# Altium project SCROD_TO_RJ45_BOARD.PrjPcb
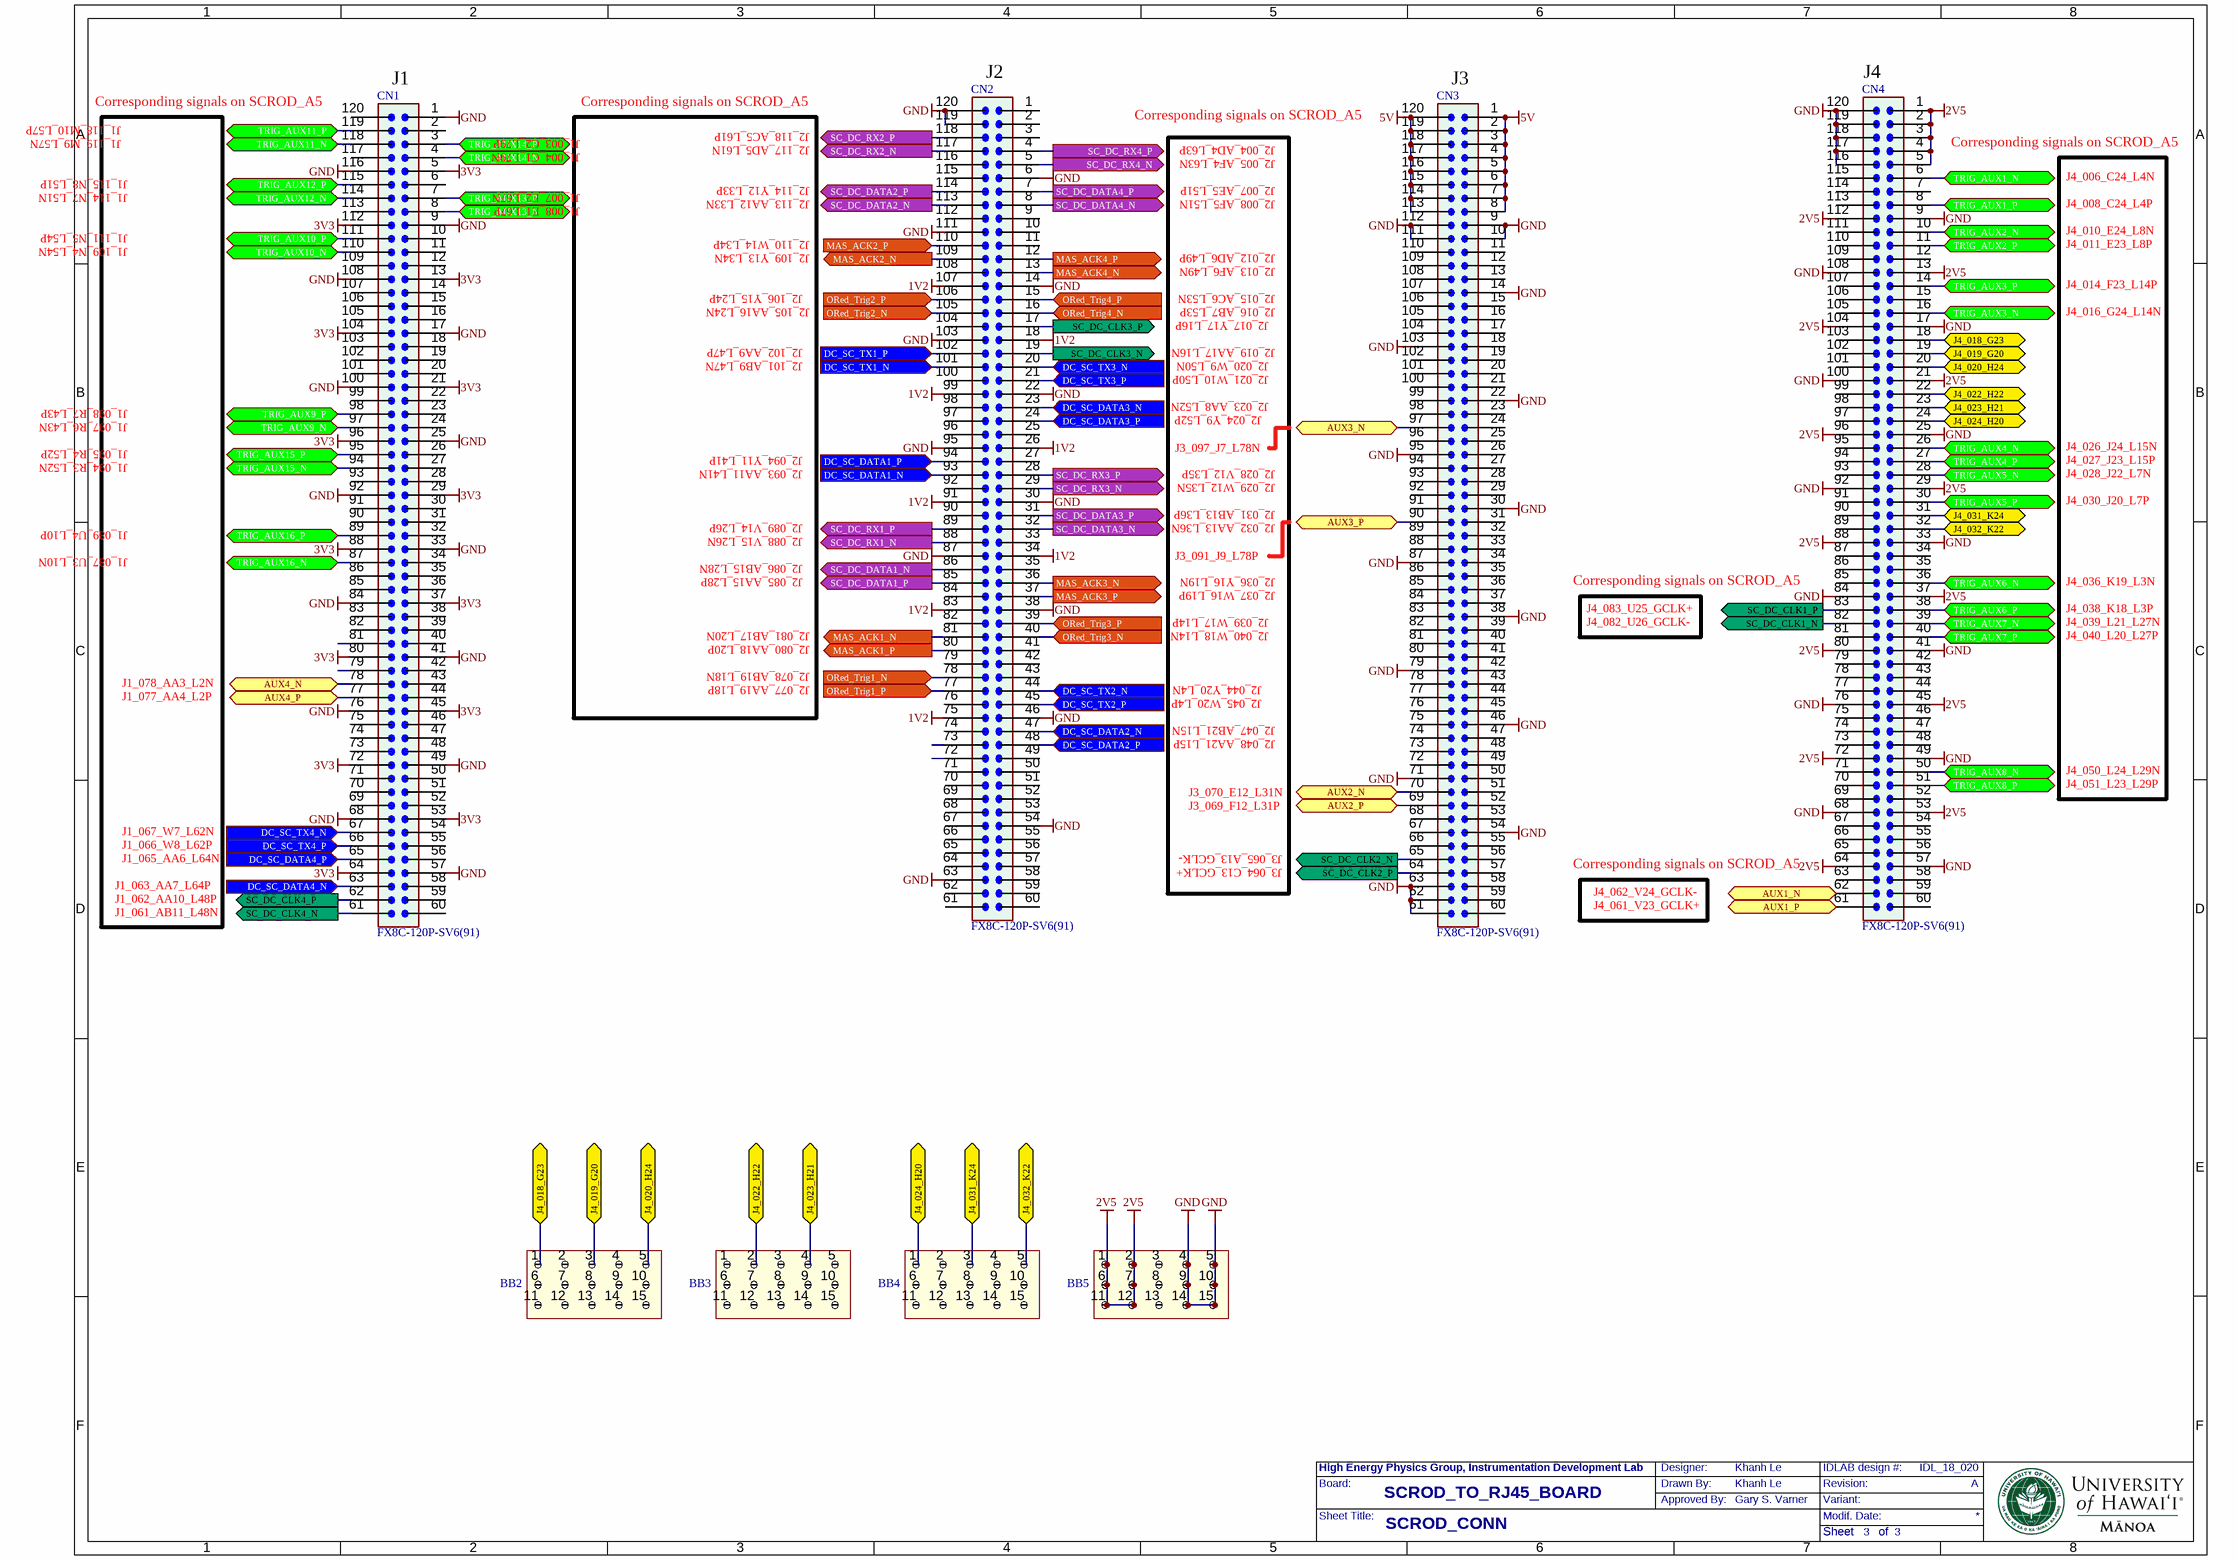
[diagram p0: SCROD_CONN_A2.SchDoc]
Approved_By: Gary S. Varner; BoardName: SCROD_TO_RJ45_BOARD; Designer: Khanh Le; Drawn_By: Khanh Le; IDLnum: IDL_18_020; ProjectName1: HMB; RevNum: A
3 sheets, 66 parts. Net scope: flat (ports and power ports of the same name join across sheets).
Board file: IDL_18_020.PcbDoc
Sheets:
  PRJHdr_IDL_18_020.SchDoc
  SCROD_CONN_A2.SchDoc
  FMC_CONN_A1.SchDoc

## Sheet PRJHdr_IDL_18_020.SchDoc: SCROD_TO_FMC_BOARD
size 401 x 291 mm; DocumentNumber: 1; SheetNumber: 1; SheetTotal: 3; Project_IT-Code: XXXX

### Notes on the sheet
- High Energy Physics Group
- Instrumentation Development Laboratory
- 2505 Correa Road, Honolulu, HI 96822
- Production Documentation for:
- Board Name:
- Project Name:
- IDL num:
- Revision:
- Variant:
- Designer:
- Drawn by:
- Approved by:
- Project name:
- High Energy Physics Group, Instrumentation Development Lab
- Drawn By:
- Approved By:
- IDLAB design #:
- Board name:
- Modif. Date:
- Sheet       of

## Sheet SCROD_CONN_A2.SchDoc: SCROD_CONN
size 401 x 291 mm; DocumentNumber: 3; SheetNumber: 3; SheetTotal: 3

### Parts
BB2  (no value)  [Breadboard_3x5_100mil_pitch]
BB3  (no value)  [Breadboard_3x5_100mil_pitch]
BB4  (no value)  [Breadboard_3x5_100mil_pitch]
BB5  (no value)  [Breadboard_3x5_100mil_pitch]
CN1  FX8C-120P-SV6(91)  [FX8C-120P-SV6(91)]
CN2  FX8C-120P-SV6(91)  [FX8C-120P-SV6(91)]
CN3  FX8C-120P-SV6(91)  [FX8C-120P-SV6(91)]
CN4  FX8C-120P-SV6(91)  [FX8C-120P-SV6(91)]

### Ports
AUX1_N (bidir), AUX1_P (bidir), AUX2_N (bidir), AUX2_P (bidir), AUX3_N (bidir), AUX3_P (bidir), AUX4_N (bidir), AUX4_P (bidir), DC_SC_DATA1_N (in), DC_SC_DATA1_P (in), DC_SC_DATA2_N (in), DC_SC_DATA2_P (in), DC_SC_DATA3_N (in), DC_SC_DATA3_P (in), DC_SC_DATA4_N (in), DC_SC_DATA4_P (in), DC_SC_TX1_N (in), DC_SC_TX1_P (in), DC_SC_TX2_N (in), DC_SC_TX2_P (in), DC_SC_TX3_N (in), DC_SC_TX3_P (in), DC_SC_TX4_N (in), DC_SC_TX4_P (in), J4_018_G23 (bidir), J4_019_G20 (bidir), J4_020_H24 (bidir), J4_022_H22 (bidir), J4_023_H21 (bidir), J4_024_H20 (bidir), J4_031_K24 (bidir), J4_032_K22 (bidir), MAS_ACK1_N (out), MAS_ACK1_P (out), MAS_ACK2_N (out), MAS_ACK2_P (in), MAS_ACK3_N (out), MAS_ACK3_P (out), MAS_ACK4_N (out), MAS_ACK4_P (out), ORed_Trig1_N (in), ORed_Trig1_P (in), ORed_Trig2_N (in), ORed_Trig2_P (in), ORed_Trig3_N (in), ORed_Trig3_P (in), ORed_Trig4_N (in), ORed_Trig4_P (in), SC_DC_CLK1_N (out), SC_DC_CLK1_P (out), SC_DC_CLK2_N (out), SC_DC_CLK2_P (out), SC_DC_CLK3_N (out), SC_DC_CLK3_P (out), SC_DC_CLK4_N (out), SC_DC_CLK4_P (out), SC_DC_DATA1_N (out), SC_DC_DATA1_P (out), SC_DC_DATA2_N (out), SC_DC_DATA2_P (out), SC_DC_DATA3_N (out), SC_DC_DATA3_P (out), SC_DC_DATA4_N (out), SC_DC_DATA4_P (out), SC_DC_RX1_N (out), SC_DC_RX1_P (out), SC_DC_RX2_N (out), SC_DC_RX2_P (out), SC_DC_RX3_N (out), SC_DC_RX3_P (out), SC_DC_RX4_N (out), SC_DC_RX4_P (out), TRIG_AUX1_N (bidir), TRIG_AUX1_P (bidir), TRIG_AUX2_N (bidir), TRIG_AUX2_P (bidir), TRIG_AUX3_N (bidir), TRIG_AUX3_P (bidir), TRIG_AUX4_N (bidir), TRIG_AUX4_P (bidir), TRIG_AUX5_N (bidir), TRIG_AUX5_P (bidir), TRIG_AUX6_N (bidir), TRIG_AUX6_P (bidir), TRIG_AUX7_N (bidir), TRIG_AUX7_P (bidir), TRIG_AUX8_N (bidir), TRIG_AUX8_P (bidir), TRIG_AUX9_N (bidir), TRIG_AUX9_P (bidir), TRIG_AUX10_N (bidir), TRIG_AUX10_P (bidir), TRIG_AUX11_N (bidir), TRIG_AUX11_P (bidir), TRIG_AUX12_N (bidir), TRIG_AUX12_P (bidir), TRIG_AUX13_N (bidir), TRIG_AUX13_P (bidir), TRIG_AUX14_N (bidir), TRIG_AUX14_P (bidir), TRIG_AUX15_N (bidir), TRIG_AUX15_P (bidir), TRIG_AUX16_N (bidir), TRIG_AUX16_P (bidir)

### Nets
1V2: CN2.18 CN2.26 CN2.34 CN2.75 CN2.83 CN2.91 CN2.99 CN2.107
2V5: BB5.1 BB5.2 BB5.6 BB5.7 BB5.11 BB5.12 CN4.1 CN4.2 CN4.3 CN4.4 CN4.5 CN4.13 CN4.21 CN4.29 CN4.37 CN4.45 CN4.53 CN4.64 CN4.72 CN4.80 CN4.88 CN4.96 CN4.104 CN4.112
3V3: CN1.5 CN1.13 CN1.21 CN1.29 CN1.37 CN1.45 CN1.53 CN1.64 CN1.72 CN1.80 CN1.88 CN1.96 CN1.104 CN1.112
5V: CN3.1 CN3.2 CN3.3 CN3.4 CN3.5 CN3.6 CN3.7 CN3.8 CN3.113 CN3.114 CN3.115 CN3.116 CN3.117 CN3.118 CN3.119 CN3.120
GND: BB5.4 BB5.5 BB5.9 BB5.10 BB5.14 BB5.15 CN1.1 CN1.9 CN1.17 CN1.25 CN1.33 CN1.41 CN1.49 CN1.57 CN1.68 CN1.76 CN1.84 CN1.92 CN1.100 CN1.108 CN1.116 CN2.6 CN2.14 CN2.22 CN2.30 CN2.38 CN2.46 CN2.54 CN2.63 CN2.87 CN2.95 CN2.103 CN2.111 CN2.119 CN2.120 CN3.9 CN3.10 CN3.14 CN3.22 CN3.30 CN3.38 CN3.46 CN3.54 CN3.61 CN3.62 CN3.63 CN3.71 CN3.79 CN3.87 CN3.95 CN3.103 CN3.111 CN3.112 CN4.9 CN4.17 CN4.25 CN4.33 CN4.41 CN4.49 CN4.57 CN4.68 CN4.76 CN4.84 CN4.92 CN4.100 CN4.108 CN4.116 CN4.117 CN4.118 CN4.119 CN4.120
AUX1_N: CN4.62 ; port AUX1_N
AUX1_P: CN4.61 ; port AUX1_P
AUX2_N: CN3.70 ; port AUX2_N
AUX2_P: CN3.69 ; port AUX2_P
AUX3_N: CN3.97 ; port AUX3_N
AUX3_P: CN3.90 ; port AUX3_P
AUX4_N: CN1.78 ; port AUX4_N
AUX4_P: CN1.77 ; port AUX4_P
DC_SC_DATA1_N: CN2.93 ; port DC_SC_DATA1_N
DC_SC_DATA1_P: CN2.94 ; port DC_SC_DATA1_P
DC_SC_DATA2_N: CN2.47 ; port DC_SC_DATA2_N
DC_SC_DATA2_P: CN2.48 ; port DC_SC_DATA2_P
DC_SC_DATA3_N: CN2.23 ; port DC_SC_DATA3_N
DC_SC_DATA3_P: CN2.24 ; port DC_SC_DATA3_P
DC_SC_DATA4_N: CN1.63 ; port DC_SC_DATA4_N
DC_SC_DATA4_P: CN1.65 ; port DC_SC_DATA4_P
DC_SC_TX1_N: CN2.101 ; port DC_SC_TX1_N
DC_SC_TX1_P: CN2.102 ; port DC_SC_TX1_P
DC_SC_TX2_N: CN2.44 ; port DC_SC_TX2_N
DC_SC_TX2_P: CN2.45 ; port DC_SC_TX2_P
DC_SC_TX3_N: CN2.20 ; port DC_SC_TX3_N
DC_SC_TX3_P: CN2.21 ; port DC_SC_TX3_P
DC_SC_TX4_N: CN1.67 ; port DC_SC_TX4_N
DC_SC_TX4_P: CN1.66 ; port DC_SC_TX4_P
J4_018_G23: BB2.1 CN4.18 ; port J4_018_G23
J4_019_G20: BB2.3 CN4.19 ; port J4_019_G20
J4_020_H24: BB2.5 CN4.20 ; port J4_020_H24
J4_022_H22: BB3.2 CN4.22 ; port J4_022_H22
J4_023_H21: BB3.4 CN4.23 ; port J4_023_H21
J4_024_H20: BB4.1 CN4.24 ; port J4_024_H20
J4_031_K24: BB4.3 CN4.31 ; port J4_031_K24
J4_032_K22: BB4.5 CN4.32 ; port J4_032_K22
MAS_ACK1_N: CN2.81 ; port MAS_ACK1_N
MAS_ACK1_P: CN2.80 ; port MAS_ACK1_P
MAS_ACK2_N: CN2.109 ; port MAS_ACK2_N
MAS_ACK2_P: CN2.110 ; port MAS_ACK2_P
MAS_ACK3_N: CN2.36 ; port MAS_ACK3_N
MAS_ACK3_P: CN2.37 ; port MAS_ACK3_P
MAS_ACK4_N: CN2.13 ; port MAS_ACK4_N
MAS_ACK4_P: CN2.12 ; port MAS_ACK4_P
ORed_Trig1_N: CN2.78 ; port ORed_Trig1_N
ORed_Trig1_P: CN2.77 ; port ORed_Trig1_P
ORed_Trig2_N: CN2.105 ; port ORed_Trig2_N
ORed_Trig2_P: CN2.106 ; port ORed_Trig2_P
ORed_Trig3_N: CN2.40 ; port ORed_Trig3_N
ORed_Trig3_P: CN2.39 ; port ORed_Trig3_P
ORed_Trig4_N: CN2.16 ; port ORed_Trig4_N
ORed_Trig4_P: CN2.15 ; port ORed_Trig4_P
SC_DC_CLK1_N: CN4.82 ; port SC_DC_CLK1_N
SC_DC_CLK1_P: CN4.83 ; port SC_DC_CLK1_P
SC_DC_CLK2_N: CN3.65 ; port SC_DC_CLK2_N
SC_DC_CLK2_P: CN3.64 ; port SC_DC_CLK2_P
SC_DC_CLK3_N: CN2.19 ; port SC_DC_CLK3_N
SC_DC_CLK3_P: CN2.17 ; port SC_DC_CLK3_P
SC_DC_CLK4_N: CN1.61 ; port SC_DC_CLK4_N
SC_DC_CLK4_P: CN1.62 ; port SC_DC_CLK4_P
SC_DC_DATA1_N: CN2.86 ; port SC_DC_DATA1_N
SC_DC_DATA1_P: CN2.85 ; port SC_DC_DATA1_P
SC_DC_DATA2_N: CN2.113 ; port SC_DC_DATA2_N
SC_DC_DATA2_P: CN2.114 ; port SC_DC_DATA2_P
SC_DC_DATA3_N: CN2.32 ; port SC_DC_DATA3_N
SC_DC_DATA3_P: CN2.31 ; port SC_DC_DATA3_P
SC_DC_DATA4_N: CN2.8 ; port SC_DC_DATA4_N
SC_DC_DATA4_P: CN2.7 ; port SC_DC_DATA4_P
SC_DC_RX1_N: CN2.88 ; port SC_DC_RX1_N
SC_DC_RX1_P: CN2.89 ; port SC_DC_RX1_P
SC_DC_RX2_N: CN2.117 ; port SC_DC_RX2_N
SC_DC_RX2_P: CN2.118 ; port SC_DC_RX2_P
SC_DC_RX3_N: CN2.29 ; port SC_DC_RX3_N
SC_DC_RX3_P: CN2.28 ; port SC_DC_RX3_P
SC_DC_RX4_N: CN2.5 ; port SC_DC_RX4_N
SC_DC_RX4_P: CN2.4 ; port SC_DC_RX4_P
TRIG_AUX1_N: CN4.6 ; port TRIG_AUX1_N
TRIG_AUX1_P: CN4.8 ; port TRIG_AUX1_P
TRIG_AUX2_N: CN4.10 ; port TRIG_AUX2_N
TRIG_AUX2_P: CN4.11 ; port TRIG_AUX2_P
TRIG_AUX3_N: CN4.16 ; port TRIG_AUX3_N
TRIG_AUX3_P: CN4.14 ; port TRIG_AUX3_P
TRIG_AUX4_N: CN4.26 ; port TRIG_AUX4_N
TRIG_AUX4_P: CN4.27 ; port TRIG_AUX4_P
TRIG_AUX5_N: CN4.28 ; port TRIG_AUX5_N
TRIG_AUX5_P: CN4.30 ; port TRIG_AUX5_P
TRIG_AUX6_N: CN4.36 ; port TRIG_AUX6_N
TRIG_AUX6_P: CN4.38 ; port TRIG_AUX6_P
TRIG_AUX7_N: CN4.39 ; port TRIG_AUX7_N
TRIG_AUX7_P: CN4.40 ; port TRIG_AUX7_P
TRIG_AUX8_N: CN4.50 ; port TRIG_AUX8_N
TRIG_AUX8_P: CN4.51 ; port TRIG_AUX8_P
TRIG_AUX9_N: CN1.97 ; port TRIG_AUX9_N
TRIG_AUX9_P: CN1.98 ; port TRIG_AUX9_P
TRIG_AUX10_N: CN1.110 ; port TRIG_AUX10_N
TRIG_AUX10_P: CN1.111 ; port TRIG_AUX10_P
TRIG_AUX11_N: CN1.118 ; port TRIG_AUX11_N
TRIG_AUX11_P: CN1.119 ; port TRIG_AUX11_P
TRIG_AUX12_N: CN1.114 ; port TRIG_AUX12_N
TRIG_AUX12_P: CN1.115 ; port TRIG_AUX12_P
TRIG_AUX13_N: CN1.8 ; port TRIG_AUX13_N
TRIG_AUX13_P: CN1.7 ; port TRIG_AUX13_P
TRIG_AUX14_N: CN1.4 ; port TRIG_AUX14_N
TRIG_AUX14_P: CN1.3 ; port TRIG_AUX14_P
TRIG_AUX15_N: CN1.94 ; port TRIG_AUX15_N
TRIG_AUX15_P: CN1.95 ; port TRIG_AUX15_P
TRIG_AUX16_N: CN1.87 ; port TRIG_AUX16_N
TRIG_AUX16_P: CN1.89 ; port TRIG_AUX16_P

Not connected (* = marked no-connect by the designer): BB2 2 4 6 7 8 9 10 11 12 13 14 15; BB3 1 3 5 6 7 8 9 10 11 12 13 14 15; BB4 2 4 6 7 8 9 10 11 12 13 14 15; BB5 3 8 13; CN1 2 6 10 11 12 14 15 16 18 19 20 22 23 24 26 27 28 30 31 32 34 35 36 38 39 40 42 43 44 46 47 48 50 51 52 54 55 56 58 59 60 69 70 71 73 74 75 79 81 82 83 85 86 90 91 93 99 101 102 103 105 106 107 109 113 117 120; CN2 1 2 3 9 10 11 25 27 33 35 41 42 43 49 50 51 52 53 55 56 57 58 59 60 61 62 64 65 66 67 68 69 70 71 72 73 74 76 79 82 84 90 92 96 97 98 100 104 108 112 115 116; CN3 11 12 13 15 16 17 18 19 20 21 23 24 25 26 27 28 29 31 32 33 34 35 36 37 39 40 41 42 43 44 45 47 48 49 50 51 52 53 55 56 57 58 59 60 66 67 68 72 73 74 75 76 77 78 80 81 82 83 84 85 86 88 89 91 92 93 94 96 98 99 100 101 102 104 105 106 107 108 109 110; CN4 7 12 15 34 35 42 43 44 46 47 48 52 54 55 56 58 59 60 63 65 66 67 69 70 71 73 74 75 77 78 79 81 85 86 87 89 90 91 93 94 95 97 98 99 101 102 103 105 106 107 109 110 111 113 114 115

### Notes on the sheet
- (near CN1) J1
- (near CN2) J2
- (near CN3) J3
- (near CN4) J4
- (near CN1) Corresponding signals on SCROD_A5
- J1_119_M9_L57N
- J1_118_M10_L57P
- Corresponding signals on SCROD_A5
- J1_003_C2_L79P
- J1_004_C1_L79N
- J2_118_AC5_L61P
- J2_117_AD5_L61N
- J2_004_AD4_L63P
- J2_005_AF4_L63N
- (near CN4) Corresponding signals on SCROD_A5
- J1_115_N8_L51P
- J1_114_N7_L51N
- J1_111_N5_L54P
- J1_007_E2_L67N
- J1_008_E1_L67P
- J2_114_Y12_L33P
- J2_113_AA12_L33N
- J2_007_AE5_L51P
- J2_008_AF5_L51N
- J4_006_C24_L4N
- J4_008_C24_L4P
- J4_010_E24_L8N
- J1_109_N4_L54N
- J2_106_Y15_L24P
- J2_110_W14_L34P
- J2_109_Y13_L34N
- J2_012_AD6_L49P
- J2_015_AC6_L53N
- J2_013_AF6_L49N
- J4_011_E23_L8P
- J4_014_F23_L14P
- J2_102_AA9_L47P
- J2_101_AB9_L47N
- J2_105_AA16_L24N
- J2_017_Y17_L16P
- J2_020_W9_L50N
- J2_016_AB7_L53P
- J2_019_AA17_L16N
- J4_016_G24_L14N
- J1_098_R7_L43P
- J1_097_R6_L43N
- J2_024_Y9_L52P
- J2_023_AA8_L52N
- J2_021_W10_L50P
- J1_095_R4_L52P
- J1_094_R3_L52N
- J2_094_Y11_L41P
- J2_093_AA11_L41N
- J3_097_J7_L78N
- J2_028_V12_L35P
- J2_029_W12_L35N
- J4_026_J24_L15N
- J4_027_J23_L15P
- J4_028_J22_L7N
- J4_030_J20_L7P
- J1_089_U4_L10P
- J1_087_U3_L10N
- J2_089_V14_L26P
- J2_088_V15_L26N
- J2_086_AB15_L28N
- J3_091_J9_L78P
- J2_031_AB13_L36P
- J2_032_AA13_L36N
- J2_085_AA15_L28P
- J2_081_AB17_L20N
- J2_039_W17_L14P
- J2_040_W18_L14N
- J2_036_Y16_L19N
- J2_037_W16_L19P
- J4_083_U25_GCLK+
- J4_082_U26_GCLK-
- J4_036_K19_L3N
- J4_038_K18_L3P
- J4_039_L21_L27N
- J4_040_L20_L27P
- J1_077_AA4_L2P
- J1_078_AA3_L2N
- J2_080_AA18_L20P
- J2_078_AB19_L18N
- J2_077_AA19_L18P
- J2_044_Y20_L4N
- J2_045_W20_L4P
- J2_047_AB21_L15N
- J2_048_AA21_L15P
- J4_050_L24_L29N
- J1_067_W7_L62N
- J3_069_F12_L31P
- J3_070_E12_L31N
- J4_051_L23_L29P
- J1_062_AA10_L48P
- J1_063_AA7_L64P
- J1_065_AA6_L64N
- J1_066_W8_L62P
- J3_064_C13_GCLK+
- J3_065_A13_GCLK-
- J4_061_V23_GCLK+
- J4_062_V24_GCLK-
- J1_061_AB11_L48N
- Board:
- High Energy Physics Group, Instrumentation Development Lab
- Drawn By:
- Designer:
- Approved By:
- Revision:
- IDLAB design #:
- Variant:
- Sheet Title:
- Modif. Date:
- Sheet       of

### Library data of the parts
BB2-BB5 = 3X5 Breadboard: 3X5 100mil pitch Breadboard; Tech: Surface Mount
CN1-CN4 = CN_FX8C-120P-SV6(91): Hirose Connector 120pin SMD R0.6mm male; Comment2: 120pin Header 10.45mm; Sort: 610; Tech: SMDR; Manufacturer: Hirose; Manufacturer No: FX8C-120P-SV6(91); Package: 120pin SMD; Price: 5.69; Supplier: Digi-Key; Supplier No: H11527-ND

## Sheet FMC_CONN_A1.SchDoc: FMC_CONN
size A3; DocumentNumber: 2; SheetNumber: 2; SheetTotal: 3
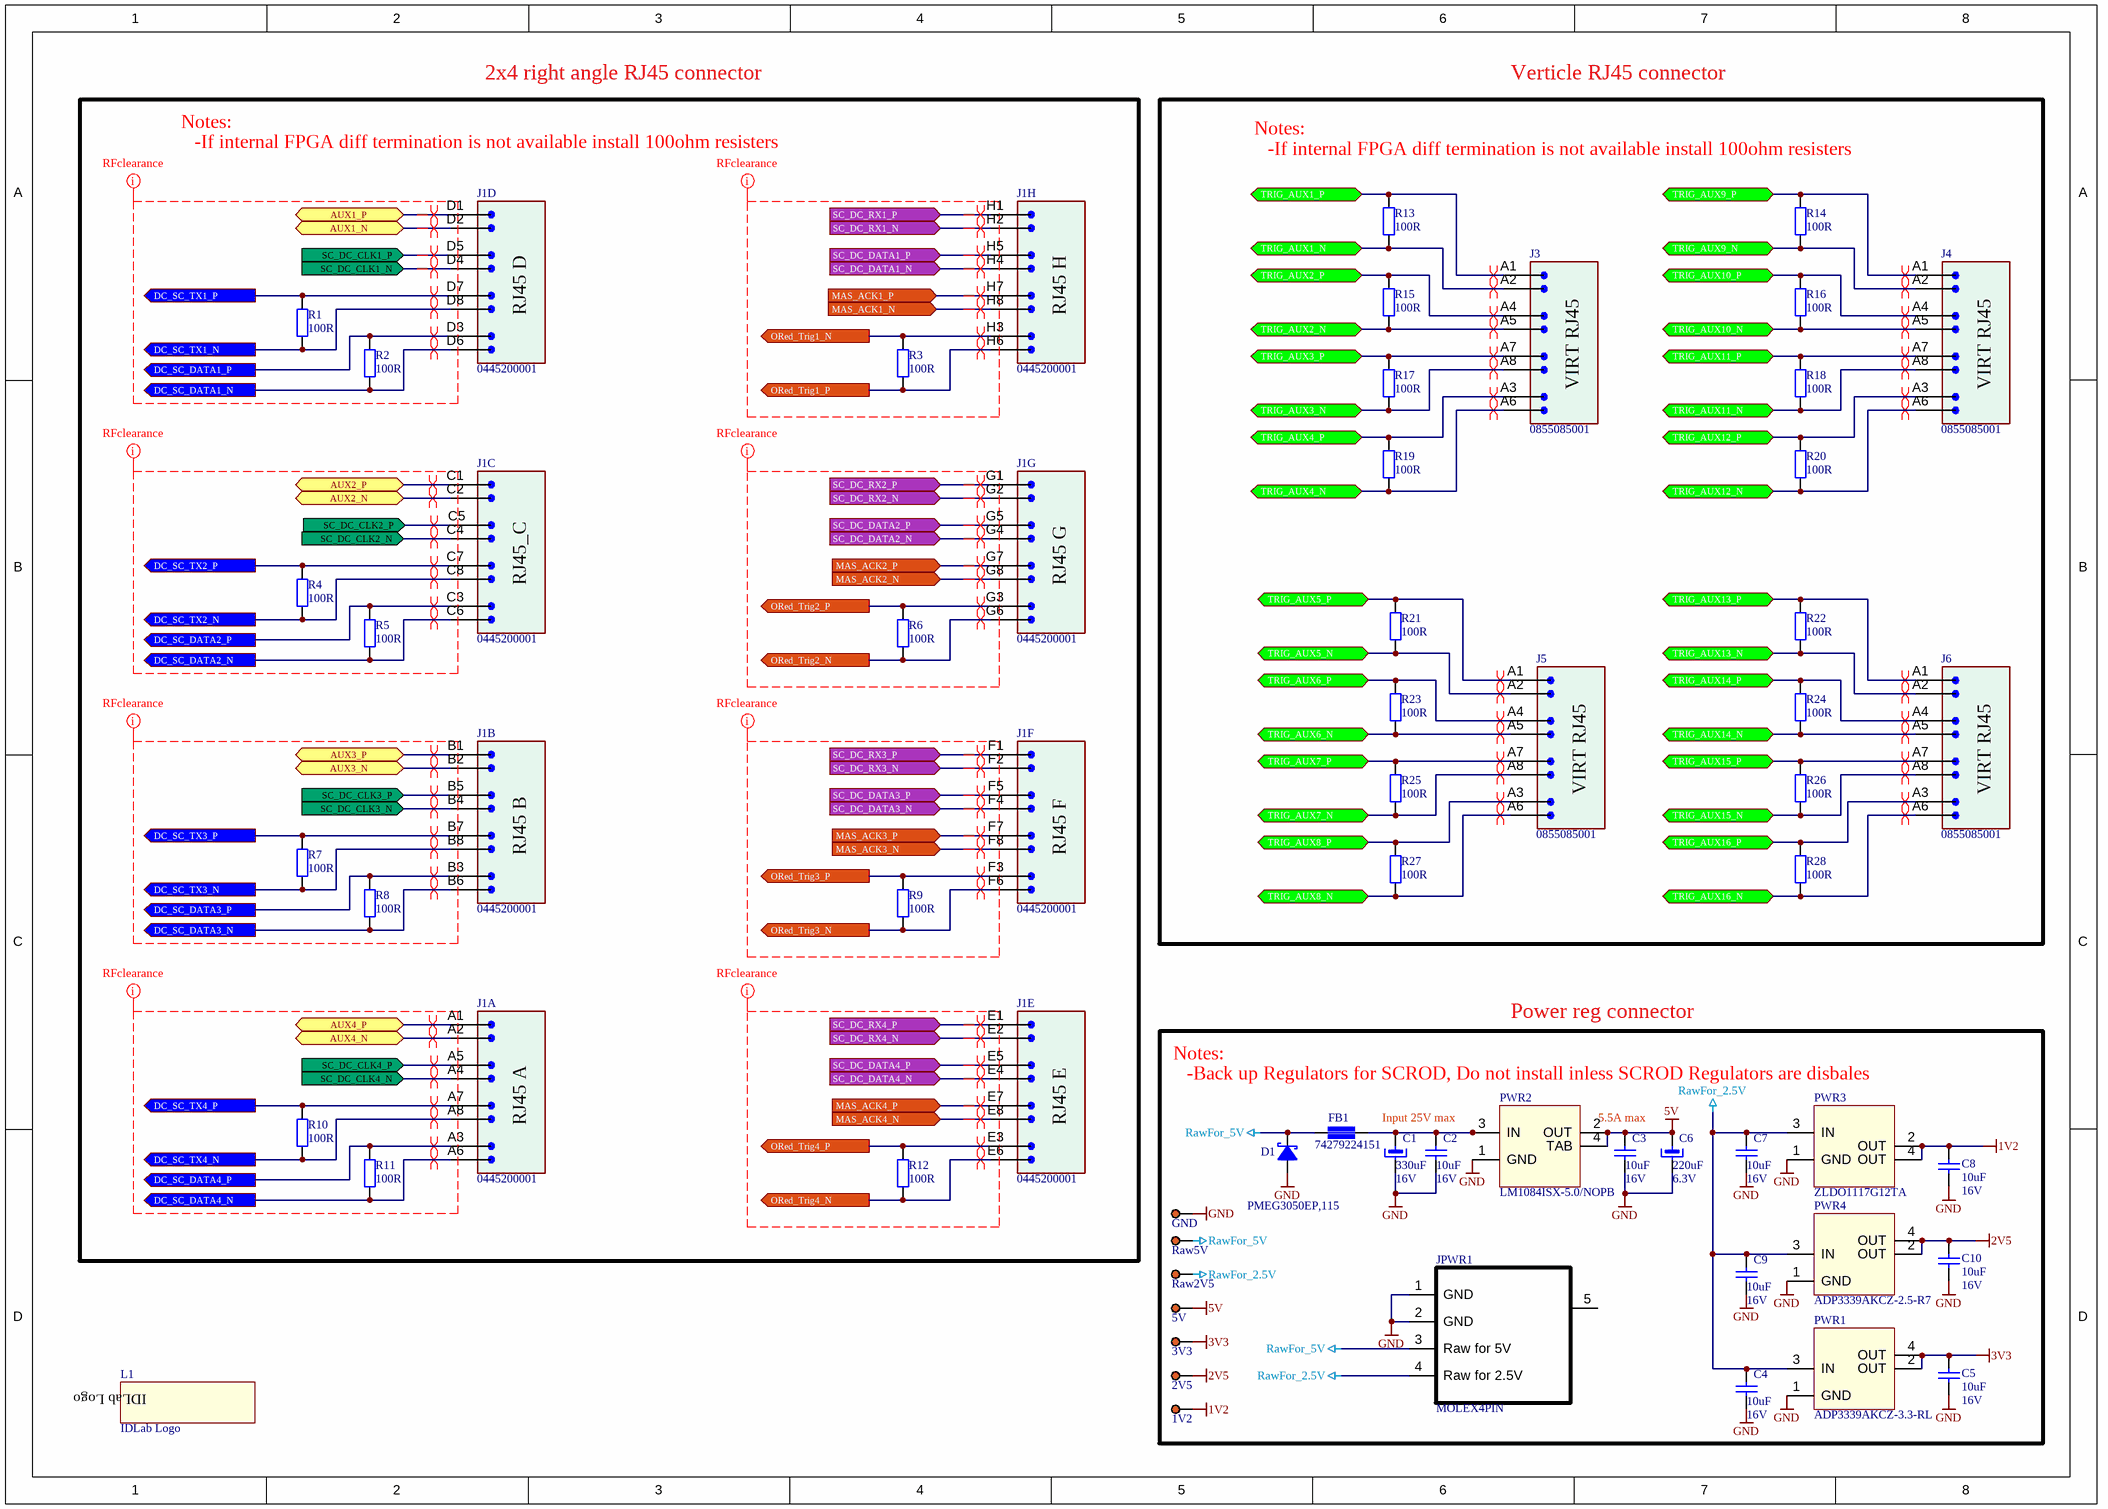
[diagram p1: FMC_CONN_A1.SchDoc]

### Parts
1V2  SP1.5S  [SP1.5SQ]  (value not drawn)  (no BOM)
2V5  SP1.5S  [SP1.5SQ]  (value not drawn)  (no BOM)
3V3  SP1.5S  [SP1.5SQ]  (value not drawn)  (no BOM)
5V  SP1.5S  [SP1.5SQ]  (value not drawn)  (no BOM)
C1  330uF  Voltage rating: 16V  [CTC-D7343-43]
C2  10uF  Voltage rating: 16V  [CC1206N1R]
C3  10uF  Voltage rating: 16V  [CC1206N1R]
C4  10uF  Voltage rating: 16V  [CC1206N1R]
C5  10uF  Voltage rating: 16V  [CC1206N1R]
C6  220uF  Voltage rating: 6.3V  [CTC-D7343-43]
C7  10uF  Voltage rating: 16V  [CC1206N1R]
C8  10uF  Voltage rating: 16V  [CC1206N1R]
C9  10uF  Voltage rating: 16V  [CC1206N1R]
C10  10uF  Voltage rating: 16V  [CC1206N1R]
D1  PMEG3050EP,115  [SOD128]
FB1  74279224151  [FB2220N1R]
GND  SP1.5S  [SP1.5SQ]  (value not drawn)  (no BOM)
J1  0445200001  [2X4 RJ45]  (parts A,B,C,D,E,F,G,H of 8)
J3  0855085001  [VIRT RJ45]
J4  0855085001  [VIRT RJ45]
J5  0855085001  [VIRT RJ45]
J6  0855085001  [VIRT RJ45]
JPWR1  MOLEX4PIN  [MOLEX_4PIN]
L1  IDLab Logo  [IDLab logo]
PWR1  ADP3339AKCZ-3.3-RL  [SOT223]
PWR2  LM1084ISX-5.0/NOPB  [TO-263-4 DDPAK]
PWR3  ZLDO1117G12TA  [SOT223]
PWR4  ADP3339AKCZ-2.5-R7  [SOT223]
R1  100R  [RC0402N1R]
R2  100R  [RC0402N1R]
R3  100R  [RC0402N1R]
R4  100R  [RC0402N1R]
R5  100R  [RC0402N1R]
R6  100R  [RC0402N1R]
R7  100R  [RC0402N1R]
R8  100R  [RC0402N1R]
R9  100R  [RC0402N1R]
R10  100R  [RC0402N1R]
R11  100R  [RC0402N1R]
R12  100R  [RC0402N1R]
R13  100R  [RC0402N1R]
R14  100R  [RC0402N1R]
R15  100R  [RC0402N1R]
R16  100R  [RC0402N1R]
R17  100R  [RC0402N1R]
R18  100R  [RC0402N1R]
R19  100R  [RC0402N1R]
R20  100R  [RC0402N1R]
R21  100R  [RC0402N1R]
R22  100R  [RC0402N1R]
R23  100R  [RC0402N1R]
R24  100R  [RC0402N1R]
R25  100R  [RC0402N1R]
R26  100R  [RC0402N1R]
R27  100R  [RC0402N1R]
R28  100R  [RC0402N1R]
Raw2V5  SP1.5S  [SP1.5SQ]  (value not drawn)  (no BOM)
Raw5V  SP1.5S  [SP1.5SQ]  (value not drawn)  (no BOM)

### Blocks framed on the sheet
2x4 right angle RJ45 connector: J1 R1-R12
Verticle RJ45 connector: J3-J6 R13-R28
Power reg connector: 1V2 2V5 3V3 5V C1-C10 D1 FB1 GND JPWR1 PWR1-PWR4 Raw2V5 Raw5V

### Ports
AUX1_N (bidir), AUX1_P (bidir), AUX2_N (bidir), AUX2_P (bidir), AUX3_N (bidir), AUX3_P (bidir), AUX4_N (bidir), AUX4_P (bidir), DC_SC_DATA1_N (out), DC_SC_DATA1_P (out), DC_SC_DATA2_N (out), DC_SC_DATA2_P (out), DC_SC_DATA3_N (out), DC_SC_DATA3_P (out), DC_SC_DATA4_N (out), DC_SC_DATA4_P (out), DC_SC_TX1_N (out), DC_SC_TX1_P (out), DC_SC_TX2_N (out), DC_SC_TX2_P (out), DC_SC_TX3_N (out), DC_SC_TX3_P (out), DC_SC_TX4_N (out), DC_SC_TX4_P (out), MAS_ACK1_N (in), MAS_ACK1_P (in), MAS_ACK2_N (in), MAS_ACK2_P (in), MAS_ACK3_N (in), MAS_ACK3_P (in), MAS_ACK4_N (in), MAS_ACK4_P (in), ORed_Trig1_N (out), ORed_Trig1_P (out), ORed_Trig2_N (out), ORed_Trig2_P (out), ORed_Trig3_N (out), ORed_Trig3_P (out), ORed_Trig4_N (out), ORed_Trig4_P (out), SC_DC_CLK1_N (in), SC_DC_CLK1_P (in), SC_DC_CLK2_N (in), SC_DC_CLK2_P (in), SC_DC_CLK3_N (in), SC_DC_CLK3_P (in), SC_DC_CLK4_N (in), SC_DC_CLK4_P (in), SC_DC_DATA1_N (in), SC_DC_DATA1_P (in), SC_DC_DATA2_N (in), SC_DC_DATA2_P (in), SC_DC_DATA3_N (in), SC_DC_DATA3_P (in), SC_DC_DATA4_N (in), SC_DC_DATA4_P (in), SC_DC_RX1_N (in), SC_DC_RX1_P (in), SC_DC_RX2_N (in), SC_DC_RX2_P (in), SC_DC_RX3_N (in), SC_DC_RX3_P (in), SC_DC_RX4_N (in), SC_DC_RX4_P (in), TRIG_AUX1_N (bidir), TRIG_AUX1_P (bidir), TRIG_AUX2_N (bidir), TRIG_AUX2_P (bidir), TRIG_AUX3_N (bidir), TRIG_AUX3_P (bidir), TRIG_AUX4_N (bidir), TRIG_AUX4_P (bidir), TRIG_AUX5_N (bidir), TRIG_AUX5_P (bidir), TRIG_AUX6_N (bidir), TRIG_AUX6_P (bidir), TRIG_AUX7_N (bidir), TRIG_AUX7_P (bidir), TRIG_AUX8_N (bidir), TRIG_AUX8_P (bidir), TRIG_AUX9_N (bidir), TRIG_AUX9_P (bidir), TRIG_AUX10_N (bidir), TRIG_AUX10_P (bidir), TRIG_AUX11_N (bidir), TRIG_AUX11_P (bidir), TRIG_AUX12_N (bidir), TRIG_AUX12_P (bidir), TRIG_AUX13_N (bidir), TRIG_AUX13_P (bidir), TRIG_AUX14_N (bidir), TRIG_AUX14_P (bidir), TRIG_AUX15_N (bidir), TRIG_AUX15_P (bidir), TRIG_AUX16_N (bidir), TRIG_AUX16_P (bidir)

### Nets
1V2: 1V2.1 C8.2 PWR3.2(OUT) PWR3.4(OUT)
2V5: 2V5.1 C10.2 PWR4.2(OUT) PWR4.4(OUT)
3V3: 3V3.1 C5.2 PWR1.2(OUT) PWR1.4(OUT)
5V: 5V.1 C3.2 C6.1 PWR2.2(OUT) PWR2.4(TAB)
GND: C1.2 C2.1 C3.1 C4.1 C5.1 C6.2 C7.1 C8.1 C9.1 C10.1 D1.2(A) GND.1 JPWR1.1(GND) JPWR1.2(GND) PWR1.1(GND) PWR2.1(GND) PWR3.1(GND) PWR4.1(GND)
RawFor_2.5V: C4.2 C7.2 C9.2 JPWR1.4(Raw_for_2.5V) PWR1.3(IN) PWR3.3(IN) PWR4.3(IN) Raw2V5.1
RawFor_5V: D1.1(C) FB1.1 JPWR1.3(Raw_for_5V) Raw5V.1
AUX1_N: J1.D2 ; port AUX1_N
AUX1_P: J1.D1 ; port AUX1_P
AUX2_N: J1.C2 ; port AUX2_N
AUX2_P: J1.C1 ; port AUX2_P
AUX3_N: J1.B2 ; port AUX3_N
AUX3_P: J1.B1 ; port AUX3_P
AUX4_N: J1.A2 ; port AUX4_N
AUX4_P: J1.A1 ; port AUX4_P
DC_SC_DATA1_N: J1.D6 R2.1 ; port DC_SC_DATA1_N
DC_SC_DATA1_P: J1.D3 R2.2 ; port DC_SC_DATA1_P
DC_SC_DATA2_N: J1.C6 R5.1 ; port DC_SC_DATA2_N
DC_SC_DATA2_P: J1.C3 R5.2 ; port DC_SC_DATA2_P
DC_SC_DATA3_N: J1.B6 R8.1 ; port DC_SC_DATA3_N
DC_SC_DATA3_P: J1.B3 R8.2 ; port DC_SC_DATA3_P
DC_SC_DATA4_N: J1.A6 R11.1 ; port DC_SC_DATA4_N
DC_SC_DATA4_P: J1.A3 R11.2 ; port DC_SC_DATA4_P
DC_SC_TX1_N: J1.D8 R1.1 ; port DC_SC_TX1_N
DC_SC_TX1_P: J1.D7 R1.2 ; port DC_SC_TX1_P
DC_SC_TX2_N: J1.C8 R4.1 ; port DC_SC_TX2_N
DC_SC_TX2_P: J1.C7 R4.2 ; port DC_SC_TX2_P
DC_SC_TX3_N: J1.B8 R7.1 ; port DC_SC_TX3_N
DC_SC_TX3_P: J1.B7 R7.2 ; port DC_SC_TX3_P
DC_SC_TX4_N: J1.A8 R10.1 ; port DC_SC_TX4_N
DC_SC_TX4_P: J1.A7 R10.2 ; port DC_SC_TX4_P
MAS_ACK1_N: J1.H8 ; port MAS_ACK1_N
MAS_ACK1_P: J1.H7 ; port MAS_ACK1_P
MAS_ACK2_N: J1.G8 ; port MAS_ACK2_N
MAS_ACK2_P: J1.G7 ; port MAS_ACK2_P
MAS_ACK3_N: J1.F8 ; port MAS_ACK3_N
MAS_ACK3_P: J1.F7 ; port MAS_ACK3_P
MAS_ACK4_N: J1.E8 ; port MAS_ACK4_N
MAS_ACK4_P: J1.E7 ; port MAS_ACK4_P
ORed_Trig1_N: J1.H3 R3.2 ; port ORed_Trig1_N
ORed_Trig1_P: J1.H6 R3.1 ; port ORed_Trig1_P
ORed_Trig2_N: J1.G6 R6.1 ; port ORed_Trig2_N
ORed_Trig2_P: J1.G3 R6.2 ; port ORed_Trig2_P
ORed_Trig3_N: J1.F6 R9.1 ; port ORed_Trig3_N
ORed_Trig3_P: J1.F3 R9.2 ; port ORed_Trig3_P
ORed_Trig4_N: J1.E6 R12.1 ; port ORed_Trig4_N
ORed_Trig4_P: J1.E3 R12.2 ; port ORed_Trig4_P
SC_DC_CLK1_N: J1.D4 ; port SC_DC_CLK1_N
SC_DC_CLK1_P: J1.D5 ; port SC_DC_CLK1_P
SC_DC_CLK2_N: J1.C4 ; port SC_DC_CLK2_N
SC_DC_CLK2_P: J1.C5 ; port SC_DC_CLK2_P
SC_DC_CLK3_N: J1.B4(B5) ; port SC_DC_CLK3_N
SC_DC_CLK3_P: J1.B5 ; port SC_DC_CLK3_P
SC_DC_CLK4_N: J1.A4 ; port SC_DC_CLK4_N
SC_DC_CLK4_P: J1.A5 ; port SC_DC_CLK4_P
SC_DC_DATA1_N: J1.H4 ; port SC_DC_DATA1_N
SC_DC_DATA1_P: J1.H5 ; port SC_DC_DATA1_P
SC_DC_DATA2_N: J1.G4 ; port SC_DC_DATA2_N
SC_DC_DATA2_P: J1.G5 ; port SC_DC_DATA2_P
SC_DC_DATA3_N: J1.F4 ; port SC_DC_DATA3_N
SC_DC_DATA3_P: J1.F5 ; port SC_DC_DATA3_P
SC_DC_DATA4_N: J1.E4 ; port SC_DC_DATA4_N
SC_DC_DATA4_P: J1.E5 ; port SC_DC_DATA4_P
SC_DC_RX1_N: J1.H2 ; port SC_DC_RX1_N
SC_DC_RX1_P: J1.H1 ; port SC_DC_RX1_P
SC_DC_RX2_N: J1.G2 ; port SC_DC_RX2_N
SC_DC_RX2_P: J1.G1 ; port SC_DC_RX2_P
SC_DC_RX3_N: J1.F2 ; port SC_DC_RX3_N
SC_DC_RX3_P: J1.F1 ; port SC_DC_RX3_P
SC_DC_RX4_N: J1.E2 ; port SC_DC_RX4_N
SC_DC_RX4_P: J1.E1 ; port SC_DC_RX4_P
TRIG_AUX1_N: J3.A2 R13.1 ; port TRIG_AUX1_N
TRIG_AUX1_P: J3.A1 R13.2 ; port TRIG_AUX1_P
TRIG_AUX2_N: J3.A5 R15.1 ; port TRIG_AUX2_N
TRIG_AUX2_P: J3.A4 R15.2 ; port TRIG_AUX2_P
TRIG_AUX3_N: J3.A8 R17.1 ; port TRIG_AUX3_N
TRIG_AUX3_P: J3.A7 R17.2 ; port TRIG_AUX3_P
TRIG_AUX4_N: J3.A6 R19.1 ; port TRIG_AUX4_N
TRIG_AUX4_P: J3.A3 R19.2 ; port TRIG_AUX4_P
TRIG_AUX5_N: J5.A2 R21.1 ; port TRIG_AUX5_N
TRIG_AUX5_P: J5.A1 R21.2 ; port TRIG_AUX5_P
TRIG_AUX6_N: J5.A5 R23.1 ; port TRIG_AUX6_N
TRIG_AUX6_P: J5.A4 R23.2 ; port TRIG_AUX6_P
TRIG_AUX7_N: J5.A8 R25.1 ; port TRIG_AUX7_N
TRIG_AUX7_P: J5.A7 R25.2 ; port TRIG_AUX7_P
TRIG_AUX8_N: J5.A6 R27.1 ; port TRIG_AUX8_N
TRIG_AUX8_P: J5.A3 R27.2 ; port TRIG_AUX8_P
TRIG_AUX9_N: J4.A2 R14.1 ; port TRIG_AUX9_N
TRIG_AUX9_P: J4.A1 R14.2 ; port TRIG_AUX9_P
TRIG_AUX10_N: J4.A5 R16.1 ; port TRIG_AUX10_N
TRIG_AUX10_P: J4.A4 R16.2 ; port TRIG_AUX10_P
TRIG_AUX11_N: J4.A8 R18.1 ; port TRIG_AUX11_N
TRIG_AUX11_P: J4.A7 R18.2 ; port TRIG_AUX11_P
TRIG_AUX12_N: J4.A6 R20.1 ; port TRIG_AUX12_N
TRIG_AUX12_P: J4.A3 R20.2 ; port TRIG_AUX12_P
TRIG_AUX13_N: J6.A2 R22.1 ; port TRIG_AUX13_N
TRIG_AUX13_P: J6.A1 R22.2 ; port TRIG_AUX13_P
TRIG_AUX14_N: J6.A5 R24.1 ; port TRIG_AUX14_N
TRIG_AUX14_P: J6.A4 R24.2 ; port TRIG_AUX14_P
TRIG_AUX15_N: J6.A8 R26.1 ; port TRIG_AUX15_N
TRIG_AUX15_P: J6.A7 R26.2 ; port TRIG_AUX15_P
TRIG_AUX16_N: J6.A6 R28.1 ; port TRIG_AUX16_N
TRIG_AUX16_P: J6.A3 R28.2 ; port TRIG_AUX16_P
NetC1_1: C1.1 C2.2 FB1.2 PWR2.3(IN)

Not connected (* = marked no-connect by the designer): JPWR1 5

### Layout directives
net class RF: (no net found under the mark)
differential pair: AUX1_N, AUX1_P, AUX2_N, AUX2_P, AUX3_N, AUX3_P, AUX4_N, AUX4_P, DC_SC_DATA1_N, DC_SC_DATA1_P, DC_SC_DATA2_N, DC_SC_DATA2_P, DC_SC_DATA3_N, DC_SC_DATA3_P, DC_SC_DATA4_N, DC_SC_DATA4_P, DC_SC_TX1_N, DC_SC_TX1_P, DC_SC_TX2_N, DC_SC_TX2_P, DC_SC_TX3_N, DC_SC_TX3_P, DC_SC_TX4_N, DC_SC_TX4_P, MAS_ACK1_N, MAS_ACK1_P, MAS_ACK2_N, MAS_ACK2_P, MAS_ACK3_N, MAS_ACK3_P, MAS_ACK4_N, MAS_ACK4_P, ORed_Trig1_N, ORed_Trig1_P, ORed_Trig2_N, ORed_Trig2_P, ORed_Trig3_N, ORed_Trig3_P, ORed_Trig4_N, ORed_Trig4_P, SC_DC_CLK1_N, SC_DC_CLK1_P, SC_DC_CLK2_N, SC_DC_CLK2_P, SC_DC_CLK3_N, SC_DC_CLK3_P, SC_DC_CLK4_N, SC_DC_CLK4_P, SC_DC_DATA1_N, SC_DC_DATA1_P, SC_DC_DATA2_N, SC_DC_DATA2_P, SC_DC_DATA3_N, SC_DC_DATA3_P, SC_DC_DATA4_N, SC_DC_DATA4_P, SC_DC_RX1_N, SC_DC_RX1_P, SC_DC_RX2_N, SC_DC_RX2_P, SC_DC_RX3_N, SC_DC_RX3_P, SC_DC_RX4_N, SC_DC_RX4_P, TRIG_AUX1_N, TRIG_AUX1_P, TRIG_AUX2_N, TRIG_AUX2_P, TRIG_AUX3_N, TRIG_AUX3_P, TRIG_AUX4_N, TRIG_AUX4_P, TRIG_AUX5_N, TRIG_AUX5_P, TRIG_AUX6_N, TRIG_AUX6_P, TRIG_AUX7_N, TRIG_AUX7_P, TRIG_AUX8_N, TRIG_AUX8_P, TRIG_AUX9_N, TRIG_AUX9_P, TRIG_AUX10_N, TRIG_AUX10_P, TRIG_AUX11_N, TRIG_AUX11_P, TRIG_AUX12_N, TRIG_AUX12_P, TRIG_AUX13_N, TRIG_AUX13_P, TRIG_AUX14_N, TRIG_AUX14_P, TRIG_AUX15_N, TRIG_AUX15_P, TRIG_AUX16_N, TRIG_AUX16_P

### Notes on the sheet
- Notes:
- -If internal FPGA diff termination is not available install 100ohm resisters
- -Back up Regulators for SCROD, Do not install inless SCROD Regulators are disbales
- Input 25V max
- 5.5A max
- Board:
- High Energy Physics Group, Instrumentation Development Lab
- Drawn By:
- Designer:
- Approved By:
- Revision:
- IDLAB design #:
- Variant:
- Sheet Title:
- Modif. Date:
- Sheet       of
- (in symbol 2x4 RJ45 CONN, part A) RJ45 A
- (in symbol 2x4 RJ45 CONN, part B) RJ45 B
- (in symbol 2x4 RJ45 CONN, part C) RJ45_C
- (in symbol 2x4 RJ45 CONN, part D) RJ45 D
- (in symbol 2x4 RJ45 CONN, part E) RJ45 E
- (in symbol 2x4 RJ45 CONN, part F) RJ45 F
- (in symbol 2x4 RJ45 CONN, part G) RJ45 G
- (in symbol 2x4 RJ45 CONN, part H) RJ45 H
- (in symbol VIRT RJ45 CONN) VIRT RJ45

### Library data of the parts
1V2 2V5 3V3 5V GND Raw2V5 Raw5V = SP1.5S: Wire solder pin 1.5mm; Sort: 610; Tech: THDW; Price: 0
C1 = CAPT7343_330U_16V: 330µF Molded Tantalum - Polymer Capacitors 16V; Manufacturer: Kemet; Manufacturer No: T521X337M016ATE050; Tech: SMDR; Package: Tant SMD D 7343-43; Supplier 1: Digi-Key; Supplier Part Number 1: 399-10365-6-ND
C2-C5 C7-C10 = CAPCC1206_10U_16VX7R: 10µF 16V Ceramic Capacitor X7R 1206; Manufacturer: TDK; Manufacturer No: C3216X7R1C106M160AC; Tech: SMDR; Package: Cap Chip 1206; Supplier 1: Digi-Key; Supplier Part Number 1: 445-1601-1-ND
C6 = CAPT7343_220U_6.3V: 220µF 6.3V Aluminum - Polymer Capacitors; Manufacturer: Panasonic; Manufacturer No: EEF-UE0J221LR; Tech: SMDR; Package: Tant SMD D 7343-43; Supplier 1: Digi-Key; Supplier Part Number 1: PCE4263CT-ND
D1 = Schottky_Diodes_5A_30V: DIODE SCHOTTKY 30V 5A SOD128  500ns 0.36Vf; Manufacturer: NXP; Tech: SMDR; Package: SMB; Manufacturer No: PMEG3050EP,115; Supplier 1: Digi-Key; Supplier Part Number 1: 568-6753-6-ND
FB1 = FB2220-74279224151: Feritte filter smd 2220 5A 10mRdc 150Rac; Manufacturer: Wurth; Tech: SMDR; Manufacturer No: 74279224151; Package: Filter Chip 2220; Supplier 1: Digi-Key; Supplier Part Number 1: 732-3423-1-ND; Supplier 2: Mouser; Supplier Part Number 2: 710-74279224151
J1 = 2x4 RJ45 CONN: CONN MOD JACK 8P8C R/A SHIELDED; Manufacturer: Molex, LLC; Tech: Through Hole, Right Angle; Manufacturer No: 0445200001; Package: RJ45, Ethernet; Supplier 1: Digi-Key; Supplier Part Number 1: WM14601-ND
J3-J6 = VIRT RJ45 CONN: CONN MOD JACK 8P8C R/A SHIELDED; Manufacturer: Molex, LLC; Tech: Through Hole, virtcal; Manufacturer No: 0855085001; Package: 8p8c virt; Supplier 1: Digi-Key; Supplier Part Number 1: WM4590-ND
PWR1 = 3V3 REG LDO: IC REG LDO 3.3V 1.5A SOT223-3; Manufacturer: Analog Devices Inc.; Tech: Surface Mount; Manufacturer No: ADP3339AKCZ-3.3-RL; Supplier 1: Digi-Key; Supplier Part Number 1: ADP3339AKCZ-3.3-RLCT-ND
PWR2 = 5V 5.5A REG LDO: IC REG LDO 5V 5A DDPAK/TO-263-3; Manufacturer: Texas Instruments; Tech: Surface Mount; Manufacturer No: LM1084ISX-5.0/NOPB; Supplier 1: Digi-Key; Supplier Part Number 1: LM1084ISX-5.0/NOPBCT-ND
PWR3 = 1V2 REG LDO: IC REG LDO 1.2V 1A SOT223-3; Manufacturer: Diodes Incorporated; Tech: Surface Mount; Manufacturer No: ZLDO1117G12TA; Supplier 1: Digi-Key; Supplier Part Number 1: ZLDO1117G12DICT-ND
PWR4 = 2V5 REG LDO: IC REG LDO 2.5V 1.5A SOT223-3; Manufacturer: Analog Devices Inc.; Tech: Surface Mount; Manufacturer No: ADP3339AKCZ-2.5-R7; Supplier 1: Digi-Key; Supplier Part Number 1: ADP3339AKCZ-2.5-R7CT-ND
R1-R28 = RES0402-100R-1%100PPM: RES SMD 100 OHM 1% 1/10W 0402; Manufacturer: Panasonic; Manufacturer No: ERJ-2RKF1000X; Tech: SMDR; Package: Res Chip 0402; Supplier 1: Digi-Key; Supplier Part Number 1: P100LCT-ND

## Nets that join several sheets
1V2: SCROD_CONN_A2 (8 pins), FMC_CONN_A1 (1V2.1 C8.2 PWR3.2 PWR3.4)
2V5: SCROD_CONN_A2 (24 pins), FMC_CONN_A1 (2V5.1 C10.2 PWR4.2 PWR4.4)
3V3: SCROD_CONN_A2 (14 pins), FMC_CONN_A1 (3V3.1 C5.2 PWR1.2 PWR1.4)
5V: SCROD_CONN_A2 (16 pins), FMC_CONN_A1 (5 pins)
GND: SCROD_CONN_A2 (71 pins), FMC_CONN_A1 (18 pins)
AUX1_N: SCROD_CONN_A2 (CN4.62), FMC_CONN_A1 (J1.D2)
AUX1_P: SCROD_CONN_A2 (CN4.61), FMC_CONN_A1 (J1.D1)
AUX2_N: SCROD_CONN_A2 (CN3.70), FMC_CONN_A1 (J1.C2)
AUX2_P: SCROD_CONN_A2 (CN3.69), FMC_CONN_A1 (J1.C1)
AUX3_N: SCROD_CONN_A2 (CN3.97), FMC_CONN_A1 (J1.B2)
AUX3_P: SCROD_CONN_A2 (CN3.90), FMC_CONN_A1 (J1.B1)
AUX4_N: SCROD_CONN_A2 (CN1.78), FMC_CONN_A1 (J1.A2)
AUX4_P: SCROD_CONN_A2 (CN1.77), FMC_CONN_A1 (J1.A1)
DC_SC_DATA1_N: SCROD_CONN_A2 (CN2.93), FMC_CONN_A1 (J1.D6 R2.1)
DC_SC_DATA1_P: SCROD_CONN_A2 (CN2.94), FMC_CONN_A1 (J1.D3 R2.2)
DC_SC_DATA2_N: SCROD_CONN_A2 (CN2.47), FMC_CONN_A1 (J1.C6 R5.1)
DC_SC_DATA2_P: SCROD_CONN_A2 (CN2.48), FMC_CONN_A1 (J1.C3 R5.2)
DC_SC_DATA3_N: SCROD_CONN_A2 (CN2.23), FMC_CONN_A1 (J1.B6 R8.1)
DC_SC_DATA3_P: SCROD_CONN_A2 (CN2.24), FMC_CONN_A1 (J1.B3 R8.2)
DC_SC_DATA4_N: SCROD_CONN_A2 (CN1.63), FMC_CONN_A1 (J1.A6 R11.1)
DC_SC_DATA4_P: SCROD_CONN_A2 (CN1.65), FMC_CONN_A1 (J1.A3 R11.2)
DC_SC_TX1_N: SCROD_CONN_A2 (CN2.101), FMC_CONN_A1 (J1.D8 R1.1)
DC_SC_TX1_P: SCROD_CONN_A2 (CN2.102), FMC_CONN_A1 (J1.D7 R1.2)
DC_SC_TX2_N: SCROD_CONN_A2 (CN2.44), FMC_CONN_A1 (J1.C8 R4.1)
DC_SC_TX2_P: SCROD_CONN_A2 (CN2.45), FMC_CONN_A1 (J1.C7 R4.2)
DC_SC_TX3_N: SCROD_CONN_A2 (CN2.20), FMC_CONN_A1 (J1.B8 R7.1)
DC_SC_TX3_P: SCROD_CONN_A2 (CN2.21), FMC_CONN_A1 (J1.B7 R7.2)
DC_SC_TX4_N: SCROD_CONN_A2 (CN1.67), FMC_CONN_A1 (J1.A8 R10.1)
DC_SC_TX4_P: SCROD_CONN_A2 (CN1.66), FMC_CONN_A1 (J1.A7 R10.2)
MAS_ACK1_N: SCROD_CONN_A2 (CN2.81), FMC_CONN_A1 (J1.H8)
MAS_ACK1_P: SCROD_CONN_A2 (CN2.80), FMC_CONN_A1 (J1.H7)
MAS_ACK2_N: SCROD_CONN_A2 (CN2.109), FMC_CONN_A1 (J1.G8)
MAS_ACK2_P: SCROD_CONN_A2 (CN2.110), FMC_CONN_A1 (J1.G7)
MAS_ACK3_N: SCROD_CONN_A2 (CN2.36), FMC_CONN_A1 (J1.F8)
MAS_ACK3_P: SCROD_CONN_A2 (CN2.37), FMC_CONN_A1 (J1.F7)
MAS_ACK4_N: SCROD_CONN_A2 (CN2.13), FMC_CONN_A1 (J1.E8)
MAS_ACK4_P: SCROD_CONN_A2 (CN2.12), FMC_CONN_A1 (J1.E7)
ORed_Trig1_N: SCROD_CONN_A2 (CN2.78), FMC_CONN_A1 (J1.H3 R3.2)
ORed_Trig1_P: SCROD_CONN_A2 (CN2.77), FMC_CONN_A1 (J1.H6 R3.1)
ORed_Trig2_N: SCROD_CONN_A2 (CN2.105), FMC_CONN_A1 (J1.G6 R6.1)
ORed_Trig2_P: SCROD_CONN_A2 (CN2.106), FMC_CONN_A1 (J1.G3 R6.2)
ORed_Trig3_N: SCROD_CONN_A2 (CN2.40), FMC_CONN_A1 (J1.F6 R9.1)
ORed_Trig3_P: SCROD_CONN_A2 (CN2.39), FMC_CONN_A1 (J1.F3 R9.2)
ORed_Trig4_N: SCROD_CONN_A2 (CN2.16), FMC_CONN_A1 (J1.E6 R12.1)
ORed_Trig4_P: SCROD_CONN_A2 (CN2.15), FMC_CONN_A1 (J1.E3 R12.2)
SC_DC_CLK1_N: SCROD_CONN_A2 (CN4.82), FMC_CONN_A1 (J1.D4)
SC_DC_CLK1_P: SCROD_CONN_A2 (CN4.83), FMC_CONN_A1 (J1.D5)
SC_DC_CLK2_N: SCROD_CONN_A2 (CN3.65), FMC_CONN_A1 (J1.C4)
SC_DC_CLK2_P: SCROD_CONN_A2 (CN3.64), FMC_CONN_A1 (J1.C5)
SC_DC_CLK3_N: SCROD_CONN_A2 (CN2.19), FMC_CONN_A1 (J1.B4)
SC_DC_CLK3_P: SCROD_CONN_A2 (CN2.17), FMC_CONN_A1 (J1.B5)
SC_DC_CLK4_N: SCROD_CONN_A2 (CN1.61), FMC_CONN_A1 (J1.A4)
SC_DC_CLK4_P: SCROD_CONN_A2 (CN1.62), FMC_CONN_A1 (J1.A5)
SC_DC_DATA1_N: SCROD_CONN_A2 (CN2.86), FMC_CONN_A1 (J1.H4)
SC_DC_DATA1_P: SCROD_CONN_A2 (CN2.85), FMC_CONN_A1 (J1.H5)
SC_DC_DATA2_N: SCROD_CONN_A2 (CN2.113), FMC_CONN_A1 (J1.G4)
SC_DC_DATA2_P: SCROD_CONN_A2 (CN2.114), FMC_CONN_A1 (J1.G5)
SC_DC_DATA3_N: SCROD_CONN_A2 (CN2.32), FMC_CONN_A1 (J1.F4)
SC_DC_DATA3_P: SCROD_CONN_A2 (CN2.31), FMC_CONN_A1 (J1.F5)
SC_DC_DATA4_N: SCROD_CONN_A2 (CN2.8), FMC_CONN_A1 (J1.E4)
SC_DC_DATA4_P: SCROD_CONN_A2 (CN2.7), FMC_CONN_A1 (J1.E5)
SC_DC_RX1_N: SCROD_CONN_A2 (CN2.88), FMC_CONN_A1 (J1.H2)
SC_DC_RX1_P: SCROD_CONN_A2 (CN2.89), FMC_CONN_A1 (J1.H1)
SC_DC_RX2_N: SCROD_CONN_A2 (CN2.117), FMC_CONN_A1 (J1.G2)
SC_DC_RX2_P: SCROD_CONN_A2 (CN2.118), FMC_CONN_A1 (J1.G1)
SC_DC_RX3_N: SCROD_CONN_A2 (CN2.29), FMC_CONN_A1 (J1.F2)
SC_DC_RX3_P: SCROD_CONN_A2 (CN2.28), FMC_CONN_A1 (J1.F1)
SC_DC_RX4_N: SCROD_CONN_A2 (CN2.5), FMC_CONN_A1 (J1.E2)
SC_DC_RX4_P: SCROD_CONN_A2 (CN2.4), FMC_CONN_A1 (J1.E1)
TRIG_AUX1_N: SCROD_CONN_A2 (CN4.6), FMC_CONN_A1 (J3.A2 R13.1)
TRIG_AUX1_P: SCROD_CONN_A2 (CN4.8), FMC_CONN_A1 (J3.A1 R13.2)
TRIG_AUX2_N: SCROD_CONN_A2 (CN4.10), FMC_CONN_A1 (J3.A5 R15.1)
TRIG_AUX2_P: SCROD_CONN_A2 (CN4.11), FMC_CONN_A1 (J3.A4 R15.2)
TRIG_AUX3_N: SCROD_CONN_A2 (CN4.16), FMC_CONN_A1 (J3.A8 R17.1)
TRIG_AUX3_P: SCROD_CONN_A2 (CN4.14), FMC_CONN_A1 (J3.A7 R17.2)
TRIG_AUX4_N: SCROD_CONN_A2 (CN4.26), FMC_CONN_A1 (J3.A6 R19.1)
TRIG_AUX4_P: SCROD_CONN_A2 (CN4.27), FMC_CONN_A1 (J3.A3 R19.2)
TRIG_AUX5_N: SCROD_CONN_A2 (CN4.28), FMC_CONN_A1 (J5.A2 R21.1)
TRIG_AUX5_P: SCROD_CONN_A2 (CN4.30), FMC_CONN_A1 (J5.A1 R21.2)
TRIG_AUX6_N: SCROD_CONN_A2 (CN4.36), FMC_CONN_A1 (J5.A5 R23.1)
TRIG_AUX6_P: SCROD_CONN_A2 (CN4.38), FMC_CONN_A1 (J5.A4 R23.2)
TRIG_AUX7_N: SCROD_CONN_A2 (CN4.39), FMC_CONN_A1 (J5.A8 R25.1)
TRIG_AUX7_P: SCROD_CONN_A2 (CN4.40), FMC_CONN_A1 (J5.A7 R25.2)
TRIG_AUX8_N: SCROD_CONN_A2 (CN4.50), FMC_CONN_A1 (J5.A6 R27.1)
TRIG_AUX8_P: SCROD_CONN_A2 (CN4.51), FMC_CONN_A1 (J5.A3 R27.2)
TRIG_AUX9_N: SCROD_CONN_A2 (CN1.97), FMC_CONN_A1 (J4.A2 R14.1)
TRIG_AUX9_P: SCROD_CONN_A2 (CN1.98), FMC_CONN_A1 (J4.A1 R14.2)
TRIG_AUX10_N: SCROD_CONN_A2 (CN1.110), FMC_CONN_A1 (J4.A5 R16.1)
TRIG_AUX10_P: SCROD_CONN_A2 (CN1.111), FMC_CONN_A1 (J4.A4 R16.2)
TRIG_AUX11_N: SCROD_CONN_A2 (CN1.118), FMC_CONN_A1 (J4.A8 R18.1)
TRIG_AUX11_P: SCROD_CONN_A2 (CN1.119), FMC_CONN_A1 (J4.A7 R18.2)
TRIG_AUX12_N: SCROD_CONN_A2 (CN1.114), FMC_CONN_A1 (J4.A6 R20.1)
TRIG_AUX12_P: SCROD_CONN_A2 (CN1.115), FMC_CONN_A1 (J4.A3 R20.2)
TRIG_AUX13_N: SCROD_CONN_A2 (CN1.8), FMC_CONN_A1 (J6.A2 R22.1)
TRIG_AUX13_P: SCROD_CONN_A2 (CN1.7), FMC_CONN_A1 (J6.A1 R22.2)
TRIG_AUX14_N: SCROD_CONN_A2 (CN1.4), FMC_CONN_A1 (J6.A5 R24.1)
TRIG_AUX14_P: SCROD_CONN_A2 (CN1.3), FMC_CONN_A1 (J6.A4 R24.2)
TRIG_AUX15_N: SCROD_CONN_A2 (CN1.94), FMC_CONN_A1 (J6.A8 R26.1)
TRIG_AUX15_P: SCROD_CONN_A2 (CN1.95), FMC_CONN_A1 (J6.A7 R26.2)
TRIG_AUX16_N: SCROD_CONN_A2 (CN1.87), FMC_CONN_A1 (J6.A6 R28.1)
TRIG_AUX16_P: SCROD_CONN_A2 (CN1.89), FMC_CONN_A1 (J6.A3 R28.2)

## Assembly variants
Single-Ended Input: all parts fitted
Differential Input: all parts fitted